# EAGLE design Rx (EAGLE 9.6.2)
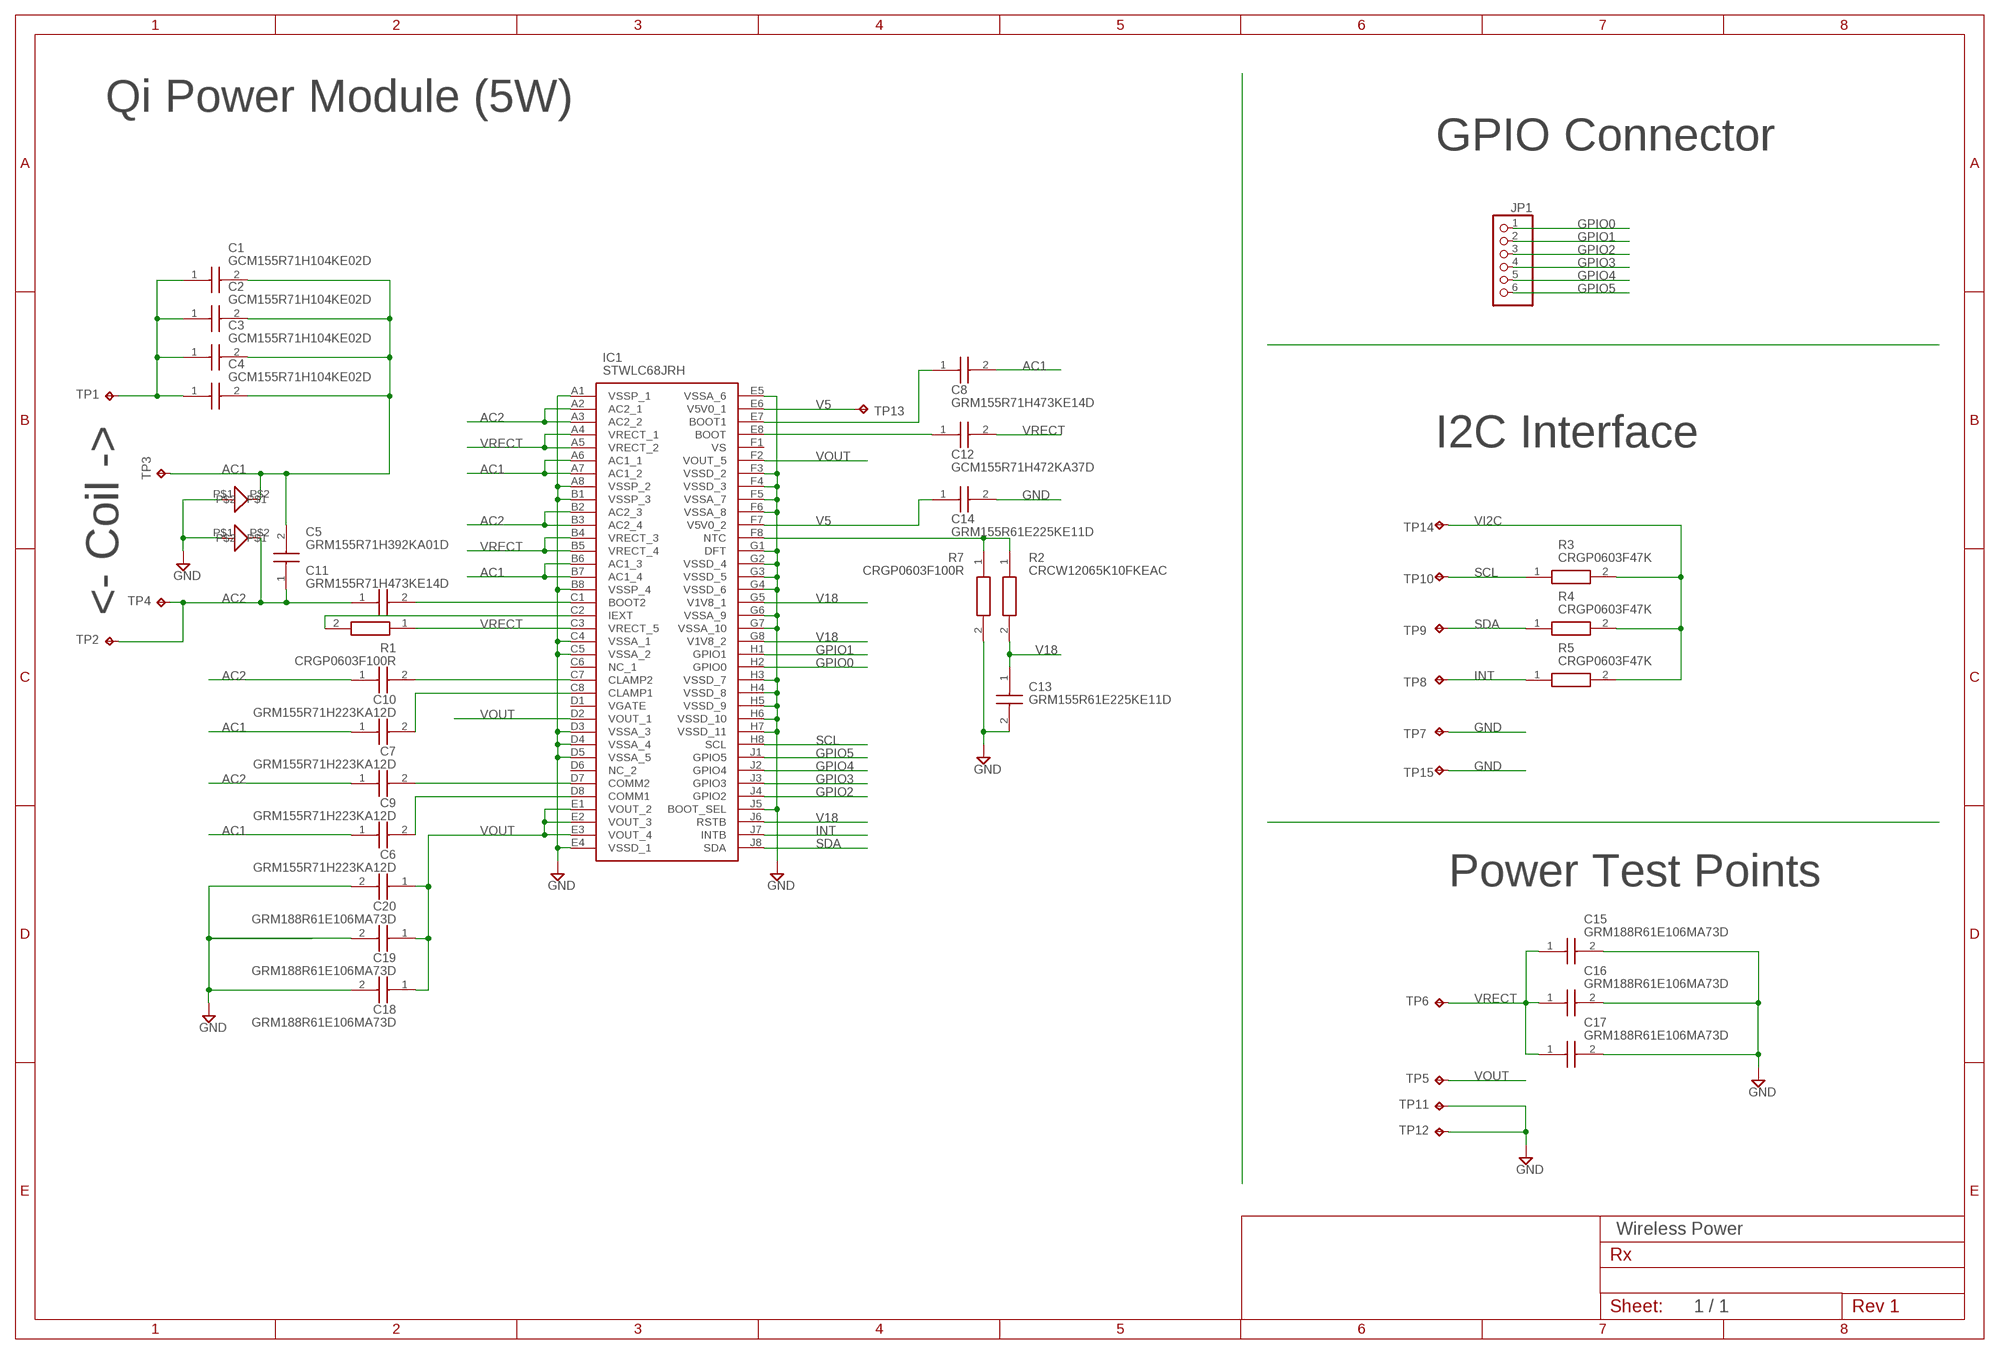
[diagram p0: schematic, sheet 1]

## Parts
C1  GCM155R71H104KE02D  [CAPC1005X55N]
C2  GCM155R71H104KE02D  [CAPC1005X55N]
C3  GCM155R71H104KE02D  [CAPC1005X55N]
C4  GCM155R71H104KE02D  [CAPC1005X55N]
C5  GRM155R71H392KA01D  [CAPC1005X55N]
C6  GRM155R71H223KA12D  [CAPC1005X55N]
C7  GRM155R71H223KA12D  [CAPC1005X55N]
C8  GRM155R71H473KE14D  [CAPC1005X55N]
C9  GRM155R71H223KA12D  [CAPC1005X55N]
C10  GRM155R71H223KA12D  [CAPC1005X55N]
C11  GRM155R71H473KE14D  [CAPC1005X55N]
C12  GCM155R71H472KA37D  [CAPC1005X55N]
C13  GRM155R61E225KE11D  [CAPC1005X55N]
C14  GRM155R61E225KE11D  [CAPC1005X55N]
C15  GRM188R61E106MA73D  [CAPC1608X90N]
C16  GRM188R61E106MA73D  [CAPC1608X90N]
C17  GRM188R61E106MA73D  [CAPC1608X90N]
C18  GRM188R61E106MA73D  [CAPC1608X90N]
C19  GRM188R61E106MA73D  [CAPC1608X90N]
C20  GRM188R61E106MA73D  [CAPC1608X90N]
IC1  STWLC68JRH  [BGA72C40P9X9_441X376X58]
JP1  PINHD-1X6  [1X06]
R1  CRGP0603F100R  [RESC1608X55N]
R2  CRCW12065K10FKEAC  [RESC3216X60N]
R3  CRGP0603F47K  [RESC1608X55N]
R4  CRGP0603F47K  [RESC1608X55N]
R5  CRGP0603F47K  [RESC1608X55N]
R7  CRGP0603F100R  [RESC1608X55N]
TP1  TPPAD1-13  [P1-13]
TP2  TPPAD1-13  [P1-13]
TP3  TPPAD1-13  [P1-13]
TP4  TPPAD1-13  [P1-13]
TP5  TPPAD1-13  [P1-13]
TP6  TPPAD1-13  [P1-13]
TP7  TPPAD1-13  [P1-13]
TP8  TPPAD1-13  [P1-13]
TP9  TPPAD1-13  [P1-13]
TP10  TPPAD1-13  [P1-13]
TP11  TPPAD1-13  [P1-13]
TP12  TPPAD1-13  [P1-13]
TP13  TPPAD1-13  [P1-13]
TP14  TPPAD1-13  [P1-13]
TP15  TPPAD1-13  [P1-13]
U$1  SMAJ16A  [SMAJ16A]
U$2  SMAJ16A  [SMAJ16A]

## Nets
AC1: C1.2 C2.2 C3.2 C4.2 C5.2 C6.1 C7.1 C8.2 IC1.A6(AC1_1) IC1.A7(AC1_2) IC1.B6(AC1_3) IC1.B7(AC1_4) TP3.TP U$1.P$2
AC2: C5.1 C9.1 C10.1 C11.1 IC1.A2(AC2_1) IC1.A3(AC2_2) IC1.B2(AC2_3) IC1.B3(AC2_4) TP2.TP TP4.TP U$2.P$2
GND: C13.2 C14.2 C15.2 C16.2 C17.2 C18.2 C19.2 C20.2 IC1.A1(VSSP_1) IC1.A8(VSSP_2) IC1.B1(VSSP_3) IC1.B8(VSSP_4) IC1.C4(VSSA_1) IC1.C5(VSSA_2) IC1.D3(VSSA_3) IC1.D4(VSSA_4) IC1.D5(VSSA_5) IC1.E4(VSSD_1) IC1.E5(VSSA_6) IC1.F3(VSSD_2) IC1.F4(VSSD_3) IC1.F5(VSSA_7) IC1.F6(VSSA_8) IC1.G1(DFT) IC1.G2(VSSD_4) IC1.G3(VSSD_5) IC1.G4(VSSD_6) IC1.G6(VSSA_9) IC1.G7(VSSA_10) IC1.H3(VSSD_7) IC1.H4(VSSD_8) IC1.H5(VSSD_9) IC1.H6(VSSD_10) IC1.H7(VSSD_11) IC1.J5(BOOT_SEL) R7.2 TP7.TP TP11.TP TP12.TP TP15.TP U$1.P$1 U$2.P$1
GPIO0: IC1.H2(GPIO0) JP1.1
GPIO1: IC1.H1(GPIO1) JP1.2
GPIO2: IC1.J4(GPIO2) JP1.3
GPIO3: IC1.J3(GPIO3) JP1.4
GPIO4: IC1.J2(GPIO4) JP1.5
GPIO5: IC1.J1(GPIO5) JP1.6
INT: IC1.J7(INTB) R5.1 TP8.TP
N$1: C6.2 IC1.D8(COMM1)
N$2: C7.2 IC1.C8(CLAMP1)
N$3: C8.1 IC1.E7(BOOT1)
N$4: C1.1 C2.1 C3.1 C4.1 TP1.TP
N$5: C11.2 IC1.C1(BOOT2)
N$6: C10.2 IC1.C7(CLAMP2)
N$7: C9.2 IC1.D7(COMM2)
N$8: C12.1 IC1.E8(BOOT)
N$9: IC1.C2(IEXT) R1.2
N$10: IC1.F8(NTC) R2.1 R7.1
SCL: IC1.H8(SCL) R3.1 TP10.TP
SDA: IC1.J8(SDA) R4.1 TP9.TP
V5: C14.1 IC1.E6(V5V0_1) IC1.F7(V5V0_2) TP13.TP
V18: C13.1 IC1.G5(V1V8_1) IC1.G8(V1V8_2) IC1.J6(RSTB) R2.2
VI2C: R3.2 R4.2 R5.2 TP14.TP
VOUT: C18.1 C19.1 C20.1 IC1.D2(VOUT_1) IC1.E1(VOUT_2) IC1.E2(VOUT_3) IC1.E3(VOUT_4) IC1.F2(VOUT_5) TP5.TP
VRECT: C12.2 C15.1 C16.1 C17.1 IC1.A4(VRECT_1) IC1.A5(VRECT_2) IC1.B4(VRECT_3) IC1.B5(VRECT_4) IC1.C3(VRECT_5) R1.1 TP6.TP
Unconnected: IC1.C6(NC_1) IC1.D1(VGATE) IC1.D6(NC_2) IC1.F1(VS)

## Notes on the sheet
- Qi Power Module (5W)
- GPIO Connector
- I2C Interface
- <- Coil ->
- Power Test Points
- Wireless Power
- 1 / 1

## Library data of the parts
C1-C4 = SamacSys_Parts:GCM155R71H104KE02D: Multilayer Ceramic Capacitors MLCC - SMD/SMT 0402 0.1uF 50volts X7R 10% Source: Datasheet <https://psearch.en.murata.com/capacitor/product/GCM155R71H104KE02#.html>; DESCRIPTION: Multilayer Ceramic Capacitors MLCC - SMD/SMT 0402 0.1uF 50volts X7R 10%; HEIGHT: 0.55mm; MANUFACTURER_NAME: Murata Electronics; MANUFACTURER_PART_NUMBER: GCM155R71H104KE02D; MOUSER_PART_NUMBER: 81-GCM155R71H104KE2D; MOUSER_PRICE-STOCK: https://www.mouser.co.uk/ProductDetail/Murata-Electronics/GCM155R71H104KE02D?qs=hNud%2FORuBR2sLZsqfoz4Fw%3D%3D
C5 = SamacSys_Parts:GRM155R71H392KA01D: Murata 0402 GRM 3.9nF Ceramic Multilayer Capacitor, 50 V dc, +125C, X7R Dielectric, +/-10% Source: Datasheet <https://datasheet.datasheetarchive.com/originals/distributors/Datasheets_SAMA/ec4f1577dddcc7a13ddad897a28002d3.pdf>; DESCRIPTION: Murata 0402 GRM 3.9nF Ceramic Multilayer Capacitor, 50 V dc, +125C, X7R Dielectric, +/-10%; HEIGHT: 0.55mm; MANUFACTURER_NAME: Murata Electronics; MANUFACTURER_PART_NUMBER: GRM155R71H392KA01D; MOUSER_PART_NUMBER: 81-GRM15R71H392KA01D; MOUSER_PRICE-STOCK: https://www.mouser.co.uk/ProductDetail/Murata-Electronics/GRM155R71H392KA01D?qs=sT7emLDNC7UjNLZb6dRgiw%3D%3D
C6 C7 C9 C10 = SamacSys_Parts:GRM155R71H223KA12D: Ceramic SMT capacitor 22nF 50Vdc Murata 0402 GRM 22nF Ceramic Multilayer Capacitor, 50 V dc, +125??C, X7R Dielectric, ??10% Source: Datasheet <https://datasheet.datasheetarchive.com/originals/distributors/Datasheets_SAMA/ec4f1577dddcc7a13ddad897a28002d3.pdf>; DESCRIPTION: Ceramic SMT capacitor 22nF 50Vdc Murata 0402 GRM 22nF Ceramic Multilayer Capacitor, 50 V dc, +125??C, X7R Dielectric, ??10%; HEIGHT: 0.55mm; MANUFACTURER_NAME: Murata Electronics; MANUFACTURER_PART_NUMBER: GRM155R71H223KA12D; MOUSER_PART_NUMBER: 81-GRM155R71H223KA12; MOUSER_PRICE-STOCK: https://www.mouser.co.uk/ProductDetail/Murata-Electronics/GRM155R71H223KA12D?qs=Dfh4SrgScWyE65FKEkixtw%3D%3D
C8 C11 = SamacSys_Parts:GRM155R71H473KE14D: Multilayer Ceramic Capacitors MLCC - SMD/SMT 0402 0.047uF 50volts X7R 10% Source: Datasheet <https://datasheet.datasheetarchive.com/originals/distributors/DKDS-10/191344.pdf>; DESCRIPTION: Multilayer Ceramic Capacitors MLCC - SMD/SMT 0402 0.047uF 50volts X7R 10%; HEIGHT: 0.55mm; MANUFACTURER_NAME: Murata Electronics; MANUFACTURER_PART_NUMBER: GRM155R71H473KE14D; MOUSER_PART_NUMBER: 81-GRM155R71H473KE4D; MOUSER_PRICE-STOCK: https://www.mouser.co.uk/ProductDetail/Murata-Electronics/GRM155R71H473KE14D?qs=hNud%2FORuBR2vKzdiNqYthQ%3D%3D
C12 = SamacSys_Parts:GCM155R71H472KA37D: Murata 0402 GCM 4.7nF Ceramic Multilayer Capacitor, 50 V dc, +125C, X7R Dielectric, +/-10% SMD Source: Datasheet <https://psearch.en.murata.com/capacitor/product/GCM155R71H472KA37#.html>; DESCRIPTION: Murata 0402 GCM 4.7nF Ceramic Multilayer Capacitor, 50 V dc, +125C, X7R Dielectric, +/-10% SMD; HEIGHT: 0.55mm; MANUFACTURER_NAME: Murata Electronics; MANUFACTURER_PART_NUMBER: GCM155R71H472KA37D; MOUSER_PART_NUMBER: 81-GCM155R71H472K37D; MOUSER_PRICE-STOCK: https://www.mouser.co.uk/ProductDetail/Murata-Electronics/GCM155R71H472KA37D?qs=QDXoN8f0aYJi%2FpaJLEInpw%3D%3D
C13 C14 = SamacSys_Parts:GRM155R61E225KE11D: Multilayer Ceramic Capacitors MLCC - SMD/SMT 0402 2.2uF 25volts X5R 10% Source: Datasheet <https://psearch.en.murata.com/capacitor/product/GRM155R61E225KE11#.html>; DESCRIPTION: Multilayer Ceramic Capacitors MLCC - SMD/SMT 0402 2.2uF 25volts X5R 10%; HEIGHT: 0.55mm; MANUFACTURER_NAME: Murata Electronics; MANUFACTURER_PART_NUMBER: GRM155R61E225KE11D; MOUSER_PART_NUMBER: 81-GRM155R61E225KE1D; MOUSER_PRICE-STOCK: https://www.mouser.co.uk/ProductDetail/Murata-Electronics/GRM155R61E225KE11D?qs=eeBpzGFlv%252B8X58bIUndZvA%3D%3D
C15-C20 = SamacSys_Parts:GRM188R61E106MA73D: Multilayer Ceramic Capacitors MLCC - SMD/SMT 0603 10uF 25volts X5R 20% Source: Datasheet <https://psearch.en.murata.com/capacitor/product/GRM188R61E106MA73#.html>; DESCRIPTION: Multilayer Ceramic Capacitors MLCC - SMD/SMT 0603 10uF 25volts X5R 20%; HEIGHT: 0.9mm; MANUFACTURER_NAME: Murata Electronics; MANUFACTURER_PART_NUMBER: GRM188R61E106MA73D; MOUSER_PART_NUMBER: 81-GRM188R61E106MA3D; MOUSER_PRICE-STOCK: https://www.mouser.co.uk/ProductDetail/Murata-Electronics/GRM188R61E106MA73D?qs=PoXZt%252B2CjACpktoD15Kv0Q%3D%3D
IC1 = SamacSys_Parts:STWLC68JRH: Wireless Charging ICs Qi-compliant inductive wireless power receiver for 5W applications Source: Datasheet <https://componentsearchengine.com/Datasheets/1/STWLC68JRH.pdf>; DESCRIPTION: Wireless Charging ICs Qi-compliant inductive wireless power receiver for 5W applications; HEIGHT: 0.585mm; MANUFACTURER_NAME: STMicroelectronics; MANUFACTURER_PART_NUMBER: STWLC68JRH; MOUSER_PART_NUMBER: 511-STWLC68JRH; MOUSER_PRICE-STOCK: https://www.mouser.co.uk/ProductDetail/STMicroelectronics/STWLC68JRH?qs=GBLSl2AkirtnTJOZ01bmug%3D%3D
JP1 = pinhead:PINHD-1X6: PIN HEADER
R1 R7 = SamacSys_Parts:CRGP0603F100R: Thick Film Resistors - SMD CRGP 0603 100R 1% SMD Resistor Source: Datasheet <https://datasheet.datasheetarchive.com/originals/distributors/DKDS-39/9272.pdf>; DESCRIPTION: Thick Film Resistors - SMD CRGP 0603 100R 1% SMD Resistor; HEIGHT: 0.55mm; MANUFACTURER_NAME: TE Connectivity; MANUFACTURER_PART_NUMBER: CRGP0603F100R; MOUSER_PART_NUMBER: 279-CRGP0603F100R; MOUSER_PRICE-STOCK: https://www.mouser.co.uk/ProductDetail/TE-Connectivity-Holsworthy/CRGP0603F100R?qs=wUXugUrL1qxgC4nsawP%2FRA%3D%3D
R2 = SamacSys_Parts:CRCW12065K10FKEAC: Thick Film Resistors - SMD 1/4Watt 5.1Kohms 1% Commercial Use Source: Datasheet <http://componentsearchengine.com/Datasheets/1/CRCW12065K10FKEAC.pdf>; DESCRIPTION: Thick Film Resistors - SMD 1/4Watt 5.1Kohms 1% Commercial Use; HEIGHT: 0.6mm; MANUFACTURER_NAME: Vishay; MANUFACTURER_PART_NUMBER: CRCW12065K10FKEAC; MOUSER_PART_NUMBER: 71-CRCW12065K10FKEAC; MOUSER_PRICE-STOCK: https://www.mouser.co.uk/ProductDetail/Vishay-Dale/CRCW12065K10FKEAC?qs=E3Y5ESvWgWNktrgtHh1MhA%3D%3D
R3-R5 = SamacSys_Parts:CRGP0603F47K: 47k 0603 Thick Film Resistor +/-1% 0.25W CRGP0603F47K Source: Datasheet <https://4donline.ihs.com/images/VipMasterIC/IC/TYEL/TYEL-S-A0005460475/TYEL-S-A0005460475-1.pdf?hkey=52A5661711E402568146F3353EA87419>; DESCRIPTION: 47k 0603 Thick Film Resistor +/-1% 0.25W CRGP0603F47K; HEIGHT: 0.55mm; MANUFACTURER_NAME: TE Connectivity; MANUFACTURER_PART_NUMBER: CRGP0603F47K; MOUSER_PART_NUMBER: 279-CRGP0603F47K; MOUSER_PRICE-STOCK: https://www.mouser.co.uk/ProductDetail/TE-Connectivity-Holsworthy/CRGP0603F47K?qs=wUXugUrL1qyWZ1Sw7fH%2FgQ%3D%3D
TP1-TP15 = testpad:TP: Test pad
U$1 U$2 = SamacSys_Parts:SMAJ16A

## Board
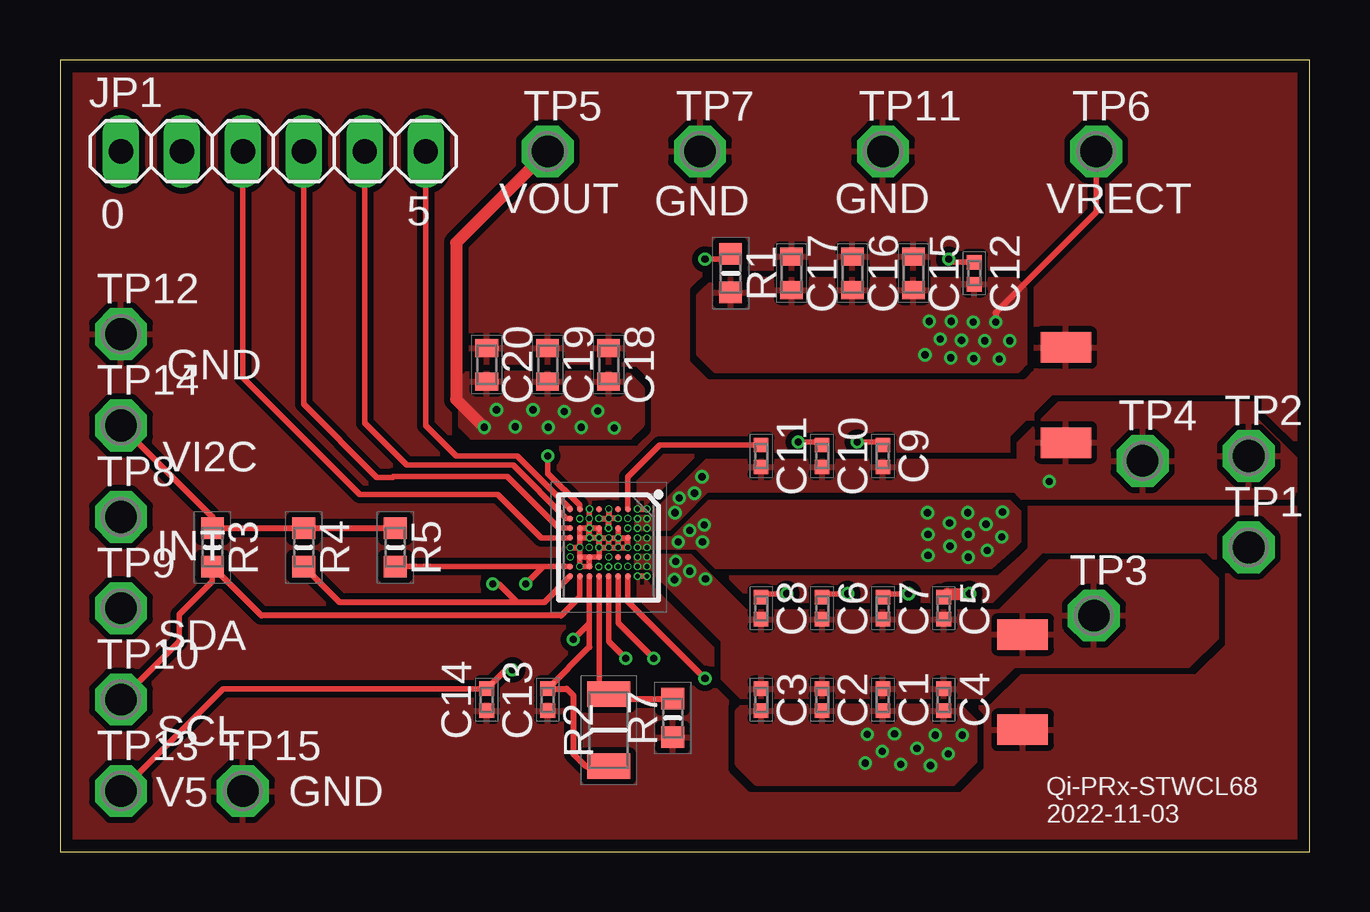
[diagram p1: board, top side]
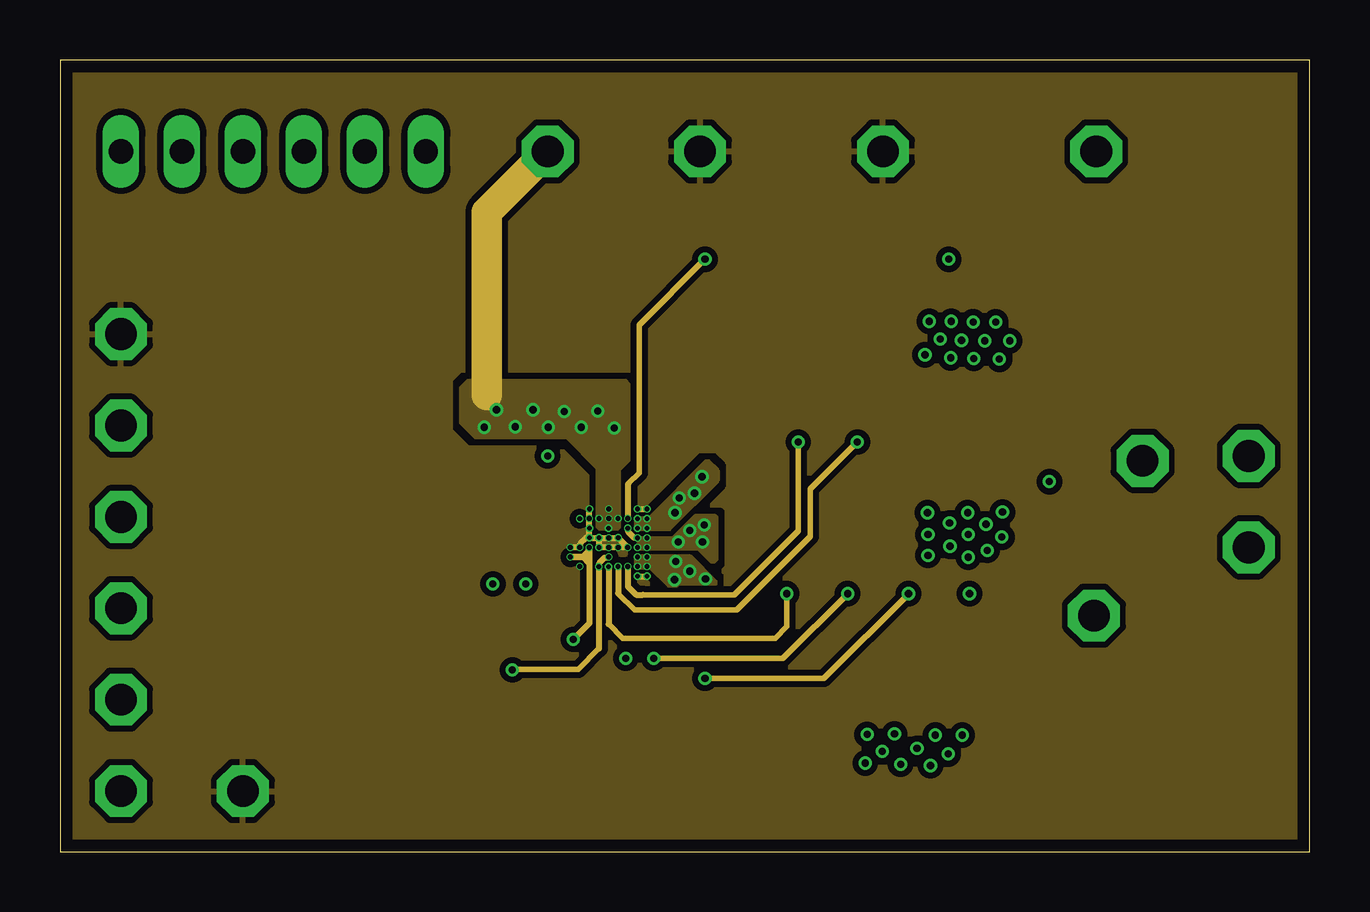
[diagram p2: board, inner layer Route2]
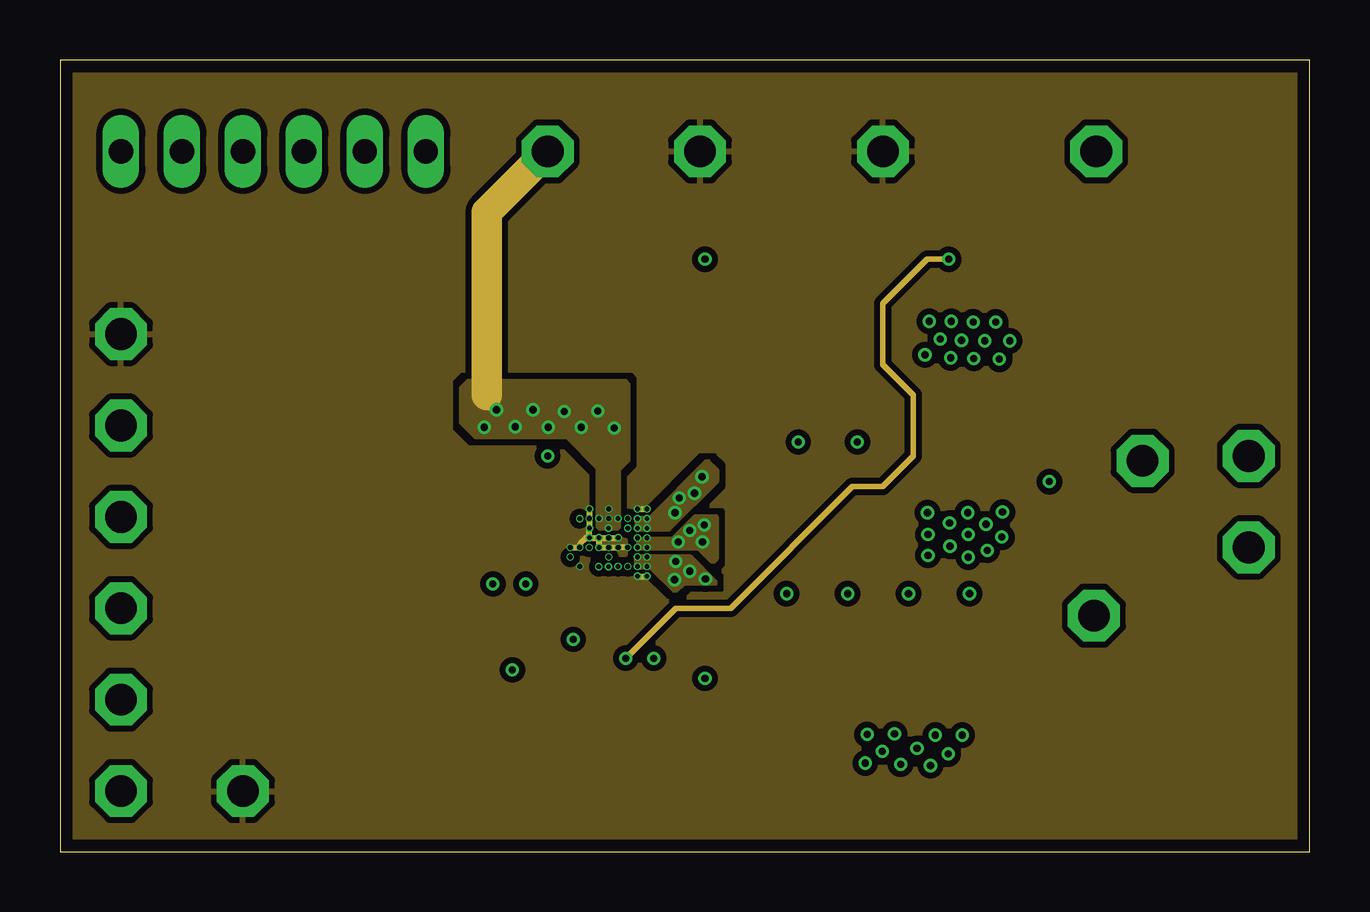
[diagram p3: board, inner layer Route15]
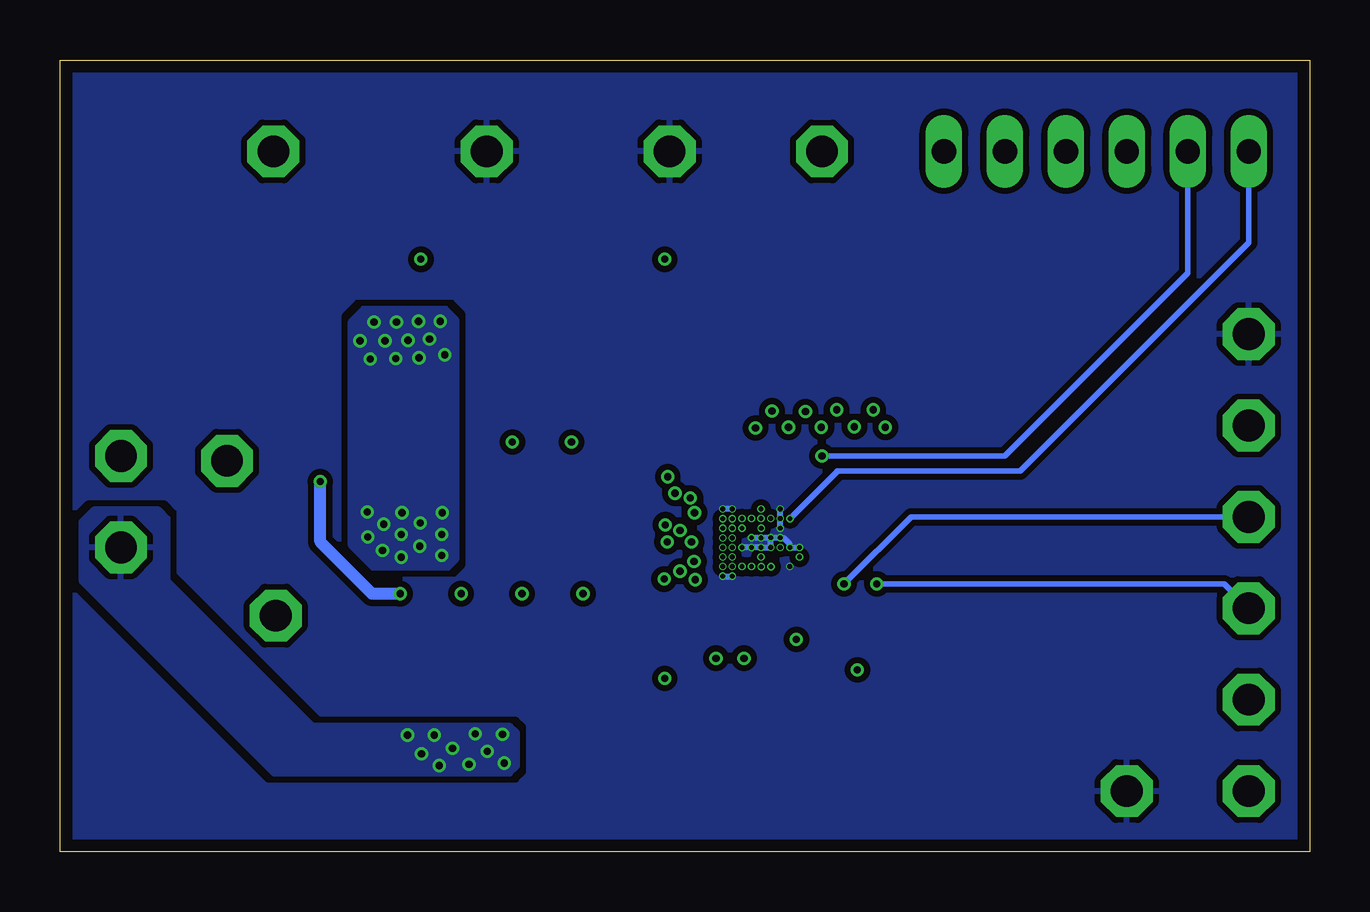
[diagram p4: board, bottom side, seen from below]

Size 52.07 x 33.02 mm. Coordinates in mm from the lower left corner, seen from the top.
Outline: 0,0 52.07,0 52.07,33.02 0,33.02 0,0
Copper layers (1+2*15+16): Top 0.0178mm / dielectric 12mil / Route2 0.0356mm / dielectric 28mil / Route15 0.0356mm / dielectric 12mil / Bottom 0.0178mm
Design rules "SSC-EAGLE-4Lyr_v1.0.0.3 *": minimum track width 6mil, minimum drill 0.2mm, track to track 4mil, track to pad 4mil, pad to pad 4mil, via to via 4mil, smd to smd 4mil, copper to edge 20mil, drill to drill 4mil, minimum pad ring 8mil, minimum via ring 2mil, stop-mask expansion 3mil, vias tented up to drill 0mil, thermal gap 10mil

### Footprints (pad centres in the part's own frame; a part is rotated, then mirrored left to right if it is on the bottom)
CAPC1005X55N = smd 0.6 x 0.62: 1 -0.46,0; 2 0.46,0
CAPC1608X90N = smd 0.75 x 0.94: 1 -0.7,0; 2 0.7,0
BGA72C40P9X9_441X376X58 = smd 0.242 x 0.242: A1 -1.6,1.6; A2 -1.2,1.6; A3 -0.8,1.6; A4 -0.4,1.6; A5 0,1.6; A6 0.4,1.6; A7 0.8,1.6; A8 1.2,1.6; B1 -1.6,1.2; B2 -1.2,1.2; B3 -0.8,1.2; B4 -0.4,1.2; B5 0,1.2; B6 0.4,1.2; B7 0.8,1.2; B8 1.2,1.2; C1 -1.6,0.8; C2 -1.2,0.8; C3 -0.8,0.8; C4 -0.4,0.8; C5 0,0.8; C6 0.4,0.8; C7 0.8,0.8; C8 1.2,0.8; D1 -1.6,0.4; D2 -1.2,0.4; D3 -0.8,0.4; D4 -0.4,0.4; D5 0,0.4; D6 0.4,0.4; D7 0.8,0.4; D8 1.2,0.4; E1 -1.6,0; E2 -1.2,0; E3 -0.8,0; E4 -0.4,0; E5 0,0; E6 0.4,0; E7 0.8,0; E8 1.2,0; F1 -1.6,-0.4; F2 -1.2,-0.4; F3 -0.8,-0.4; F4 -0.4,-0.4; F5 0,-0.4; F6 0.4,-0.4; F7 0.8,-0.4; F8 1.2,-0.4; G1 -1.6,-0.8; G2 -1.2,-0.8; G3 -0.8,-0.8; G4 -0.4,-0.8; G5 0,-0.8; G6 0.4,-0.8; G7 0.8,-0.8; G8 1.2,-0.8; H1 -1.6,-1.2; H2 -1.2,-1.2; H3 -0.8,-1.2; H4 -0.4,-1.2; H5 0,-1.2; H6 0.4,-1.2; H7 0.8,-1.2; H8 1.2,-1.2; J1 -1.6,-1.6; J2 -1.2,-1.6; J3 -0.8,-1.6; J4 -0.4,-1.6; J5 0,-1.6; J6 0.4,-1.6; J7 0.8,-1.6; J8 1.2,-1.6
1X06 = drill 1.016 long: 1 -6.35,0; 2 -3.81,0; 3 -1.27,0; 4 1.27,0; 5 3.81,0; 6 6.35,0
RESC1608X55N = smd 0.9 x 0.95: 1 -0.8,0; 2 0.8,0
RESC3216X60N = smd 1.05 x 1.8: 1 -1.5,0; 2 1.5,0
P1-13 = drill 1.321 pad 2.159 octagon: TP 0,0
SMAJ16A = smd 1.27 x 2.1: P$1 -1.985,0; P$2 1.985,0

### Placement (x,y rotation side)
C1  34.29,6.35 90 top
C2  31.75,6.35 90 top
C3  29.21,6.35 90 top
C4  36.83,6.35 90 top
C5  36.83,10.16 270 top
C6  31.75,10.16 90 top
C7  34.29,10.16 90 top
C8  29.21,10.16 270 top
C9  34.29,16.51 90 top
C10  31.75,16.51 90 top
C11  29.21,16.51 90 top
C12  38.1,24.13 270 top
C13  20.32,6.35 270 top
C14  17.78,6.35 270 top
C15  35.56,24.13 90 top
C16  33.02,24.13 90 top
C17  30.48,24.13 90 top
C18  22.86,20.32 90 top
C19  20.32,20.32 90 top
C20  17.78,20.32 90 top
IC1  22.86,12.7 270 top
JP1  8.89,29.21 0 top
R1  27.94,24.13 90 top
R2  22.86,5.08 270 top
R3  6.35,12.7 90 top
R4  10.16,12.7 90 top
R5  13.97,12.7 90 top
R7  25.53,5.59 270 top
TP1  49.53,12.7 0 top
TP2  49.53,16.51 0 top
TP3  43.08,9.86 0 top
TP4  45.11,16.31 0 top
TP5  20.32,29.21 0 top
TP6  43.18,29.21 0 top
TP7  26.67,29.21 0 top
TP8  2.54,13.97 0 top
TP9  2.54,10.16 0 top
TP10  2.54,6.35 0 top
TP11  34.29,29.21 0 top
TP12  2.54,21.59 0 top
TP13  2.54,2.54 0 top
TP14  2.54,17.78 0 top
TP15  7.62,2.54 0 top
U$1  40.11,7.09 90 top
U$2  41.91,19.05 270 top

### Tracks (layer width: path | path; a pad name or v marks a point on that pad's centre or on a via)
AC1  (via drill 0.2 pad 0.25, 0.3 pad 0.55)
  Top 0.254: IC1.B6 | IC1.A6
  other vias: 26.24,11.71 25.6,11.35 26.9,11.38 25.65,12.12 24.06,12.3 24.46,12.3 24.46,11.9 24.06,11.9
  pour Top: 48.26,11.43 48.26,8.89 47.04,7.67 39.75,7.67 38.46,6.38 28.37,6.38 27.56,7.19 27.56,8.79 24.56,11.79 24.08,11.79 23.98,11.89 23.95,11.89 23.95,12.29 24.08,12.42 26.29,12.42 28.6,10.11 39.14,10.11 41.22,12.19 47.5,12.19
  pour Top (no thermals): 27.56,8.79 24.56,11.79 24.05,11.79 23.95,11.89 23.95,12.29 24.08,12.42 26.11,12.42 28.12,10.41 28.12,9.35
  pour Top: 41.25,11.61 43.61,11.61 43.87,11.86 47.27,11.86 47.42,11.71 47.42,8.89 46.71,8.18 39.55,8.18 37.87,6.5 28.45,6.5 28.04,6.91 28.04,9.75 28.27,9.98 40.06,9.98 40.26,10.19 40.26,10.62
  pour Route15 (no thermals): 24.05,12.29 26.24,12.29 27.3,11.23 25.96,11.23 25.63,10.9 24.64,11.89 24.05,11.89
  pour Route2 (no thermals): 24.05,12.29 26.24,12.29 27.3,11.23 25.76,11.23 25.65,11.13 25.4,11.13 24.64,11.89 24.05,11.89
AC2  (via drill 0.2 pad 0.25, 0.3 pad 0.55)
  Top 0.254: IC1.A2 | IC1.B2
  Top 0.508: C5.1 36.98,10.77 v37.9,10.77
  Bottom 0.508: v37.9,10.77 39.06,10.77 41.22,12.93 v41.22,15.44
  other vias: 26.75,15.65 25.81,14.76 25.63,14.15 26.44,14.96 24.46,13.9 24.06,13.9 24.46,13.5 24.06,13.5
  pour Top: 51.69,14.99 26.29,14.99 24.69,13.39 24,13.39 24,14.02 24.56,14.02 26.92,16.38 40.51,16.38 42.67,18.54 49.02,18.54
  pour Top (no thermals): 26.92,16.38 24.56,14.02 24.05,14.02 23.95,13.92 23.95,13.51 24.03,13.44 25.43,13.44 27.57,15.58 26.92,16.23
  pour Top: 49.73,18.72 41.61,18.72 39.93,17.04 39.93,15.9 44.96,15.9 45.06,16 45.06,17.86 45.16,17.96 49.43,17.96 49.73,18.26
  pour Top: 51.41,14.71 40.06,14.71 40.82,15.47 44.63,15.47 45.39,16.23 45.39,17.93 45.72,18.26 49.71,18.26 51.71,16.26
  pour Top: 47.88,14.71 40.06,14.71 39.67,15.09 43.99,15.09 45.09,16.18 45.09,17.09 46,18.01 48.79,18.01 48.82,17.98 48.82,15.65
  pour Top: 28.12,16.26 35.79,16.26 36.14,15.9 35.64,15.39 35.64,15.24 28.07,15.24 27.89,15.42 27.89,16.03
  pour Route2 (no thermals): 24.05,13.89 24.59,13.89 26.97,16.28 27.36,15.9 27.36,15.49 25.35,13.49 24.05,13.49
  pour Route15 (no thermals): 24.08,13.89 24.05,13.87 24.05,13.49 25.35,13.49 27.36,15.49 27.36,15.9 26.97,16.28 24.59,13.89
GND  (via drill 0.2 pad 0.25)
  Top 0.229: IC1.G1 IC1.G2 IC1.G3 | IC1.G3 IC1.H3 IC1.H4 | IC1.G4 IC1.H4 | IC1.G3 IC1.F3 IC1.F4 IC1.E4 IC1.D4 | IC1.D4 IC1.D3 | IC1.D5 IC1.D4 | IC1.H4 IC1.H5 IC1.H6 | IC1.H6 IC1.H7 IC1.G7 IC1.G6 | IC1.G6 IC1.H6 | IC1.G6 IC1.F6 | IC1.F6 IC1.F5 | IC1.E4 IC1.E5 | IC1.A8 IC1.B8
  Top 0.254: IC1.A8 | IC1.B8 | IC1.C5 | IC1.E4 | IC1.F6 | IC1.G2 | v21.65,12.7 IC1.H5 IC1.J5 | IC1.D4 IC1.C4 IC1.C5 | IC1.C5 IC1.D5 IC1.E5 IC1.F5 IC1.F4 IC1.G4 IC1.G3 | IC1.B1 IC1.A1
  Route2 0.254: IC1.G4 IC1.F4 | IC1.G4 IC1.G3 IC1.G2 IC1.G1 | IC1.G4 21.92,13.1 21.68,12.85 21.68,12.72 v21.65,12.7 IC1.J5 | IC1.F4 IC1.F5 IC1.E5 IC1.D5 IC1.C5 IC1.D4 | IC1.F4 IC1.E4 IC1.D4 | IC1.D4 | IC1.B8 IC1.A8 | IC1.B1 IC1.A1
  Route15 0.254: IC1.G4 IC1.F4 | IC1.F4 IC1.F5 IC1.E5 IC1.D5 IC1.C5 | IC1.G4 IC1.G3 IC1.G2 IC1.G1 | IC1.B1 IC1.A1 | IC1.B8 IC1.A8 | IC1.F4 IC1.E4 IC1.D4 | IC1.G4 21.92,13.1 21.68,12.85 21.68,12.72 v21.65,12.7 IC1.J5
  Bottom 0.254: IC1.F4 IC1.G4 22.04,13.08 21.9,13.08 21.68,12.85 21.68,12.72 v21.65,12.7 IC1.J5 | IC1.G3 IC1.G2 IC1.G1 | IC1.B1 IC1.A1 | IC1.A8 IC1.B8 | IC1.F4 IC1.E4 IC1.D4 | IC1.C5 IC1.D5 IC1.E5 IC1.F5 IC1.F4
  other vias: 24.46,14.3 24.06,14.3 24.46,11.5 24.06,11.5 23.66,12.7 23.26,13.1 23.26,12.7 22.86,13.1 22.86,12.7 22.46,13.1 22.46,12.7 22.06,14.3 22.06,13.9 22.06,13.5 22.06,13.1 21.26,12.7 21.66,11.9
  pour Top (isolate 0.254, rank 3): 0,33.02 52.07,33.02 52.07,0 0,0
  pour Route2 (isolate 0.254, rank 3): 0,33.02 0,0 52.07,0 52.07,33.02
  pour Route15 (isolate 0.254, rank 3): 0,33.02 0,0 52.07,0 52.07,33.02
  pour Bottom (isolate 0.254, rank 3): 0,33.02 0,0 52.07,0 52.07,33.02
GPIO0  (via drill 0.2 pad 0.25)
  Top 0.254: IC1.H2 | IC1.H2 v21.65,13.89
  Bottom 0.229: JP1.1 2.54,25.4 12.06,15.88 19.68,15.88
  Bottom 0.254: v21.65,13.89 19.68,15.86 19.68,15.88
GPIO1  (via drill 0.3 pad 0.55)
  Top 0.229: IC1.H1 21.65,14.31 21.65,14.46 20.32,15.79 v20.32,16.51
  Bottom 0.229: v20.32,16.51 12.7,16.51 5.08,24.13 JP1.2
GPIO2
  Top 0.229: IC1.J4 20.05,13.1 18.24,14.91 12.5,14.91 7.62,19.79 JP1.3
GPIO3
  Top 0.229: IC1.J3 20.79,13.5 18.64,15.65 13.89,15.65 13.87,15.62 13.21,15.62 10.16,18.67 JP1.4
GPIO4
  Top 0.229: IC1.J2 21.25,13.91 21.1,13.91 18.88,16.13 14.45,16.13 12.7,17.88 JP1.5
GPIO5
  Top 0.229: IC1.J1 19.05,16.51 16.51,16.51 15.24,17.78 JP1.6
INT  (via drill 0.3 pad 0.55)
  Top 0.229: IC1.J7 20.13,11.9 | 20.13,11.9 R5.1 | v19.41,11.18 20.13,11.9
  Bottom 0.229: v19.41,11.18 16.61,13.97 TP8.TP
N$1  (via drill 0.3 pad 0.55)
  Top 0.229: C6.2 31.9,10.77 v32.82,10.77 | IC1.D8 23.26,9.56 v24.74,8.08
  Route2 0.229: v32.82,10.77 30.12,8.08 v24.74,8.08
N$2  (via drill 0.3 pad 0.55)
  Top 0.229: C7.2 34.44,10.77 v35.36,10.77 | IC1.C8 23.66,10.45 v26.87,7.24
  Route2 0.229: v35.36,10.77 31.83,7.24 v26.87,7.24
N$3  (via drill 0.2 pad 0.25, 0.3 pad 0.55)
  Top 0.229: C8.1 29.36,10.77 v30.28,10.77
  Top 0.254: IC1.E7 v22.85,11.89
  Route2 0.229: v30.28,10.77 30.28,9.4 29.79,8.91 23.44,8.91 22.86,9.5
  Route2 0.254: v22.85,11.89 v22.86,11.88 22.86,9.5
N$4  (via drill 0.3 pad 0.55)
  other vias: 33.63,4.9 34.77,4.93 35.71,4.32 34.26,4.19 33.55,3.71 35.03,3.66 36.27,3.61 37.01,4.09 36.47,4.88 37.59,4.88
  pour Bottom (no thermals): 32.92,4.65 38.2,4.65 38.2,3.89 37.62,3.3 33.55,3.3 32.92,3.94
  pour Top: 28.7,6.17 37.52,6.17 38.2,5.49 38.2,3.73 37.24,2.77 29.29,2.77 28.35,3.71 28.35,5.82
  pour Top: 28.4,6.02 37.44,6.02 37.57,5.89 37.57,4.47 32.59,4.47 30.99,2.87 29.03,2.87 28.24,3.66 28.24,5.87
  pour Bottom: 47.96,14.27 50.67,14.27 51.18,13.77 51.18,11.3 43.15,3.28 33.32,3.28 33.02,3.58 33.02,4.98 33.3,5.26 41.53,5.26 47.57,11.3 47.57,13.89
N$5
  Top 0.229: IC1.C1 23.66,15.63 25,16.97 C11.2
N$6  (via drill 0.2 pad 0.25, 0.3 pad 0.55)
  Top 0.229: v30.76,17.09 31.63,17.09 C10.2
  Top 0.254: IC1.C7
  Route2 0.229: v30.76,17.09 30.76,13.39 28.09,10.72 24.28,10.72
  Route2 0.254: IC1.C7 23.66,11.06 24,10.72 24.28,10.72
  other vias: 23.66,11.9
N$7  (via drill 0.2 pad 0.25, 0.3 pad 0.55)
  Top 0.229: v33.22,17.09 34.17,17.09 C9.2
  Top 0.254: IC1.D7 v23.25,11.9
  Route2 0.229: v33.22,17.09 31.27,15.14 31.27,13.16 28.19,10.08 23.95,10.08 23.27,10.77
  Route2 0.254: v23.25,11.9 23.25,10.78 23.27,10.77
N$8  (via drill 0.3 pad 0.55)
  Top 0.229: v23.57,8.08 22.86,8.79 IC1.E8 | C12.1 37.16,24.59 v37.03,24.71
  Route15 0.229: v23.57,8.08 25.65,10.16 27.94,10.16 33.02,15.24 34.29,15.24 35.56,16.51 35.56,19.05 34.29,20.32 34.29,22.86 36.14,24.71 v37.03,24.71
N$9  (via drill 0.2 pad 0.25, 0.3 pad 0.55)
  Top 0.229: R1.2 27.72,24.71 v26.87,24.71
  Top 0.254: IC1.C2
  Route2 0.229: v26.87,24.71 24.13,21.97 24.13,15.8 23.69,15.35
  Route2 0.254: IC1.C2 23.68,13.92 23.68,15.35 23.69,15.35
  other vias: 23.66,13.9
N$10
  Top 0.229: IC1.F8 22.46,6.98
  Top 0.254: 22.46,6.98 R2.1 23.05,6.39 R7.1
SCL
  Top 0.229: IC1.H8 21.66,10.64 20.88,9.86 | TP10.TP 4.98,8.79 4.98,9.91 6.35,11.28 R3.1
  Top 0.254: 20.88,9.86 8.39,9.86 R3.1
SDA  (via drill 0.3 pad 0.55)
  Top 0.229: IC1.J8 20.17,10.41 | v18.03,11.18 18.29,11.18 19.05,10.41
  Top 0.254: R4.1 11.65,10.41 19.05,10.41 20.17,10.41
  Bottom 0.229: v18.03,11.18 3.56,11.18 TP9.TP
V5  (via drill 0.2 pad 0.25, 0.3 pad 0.55)
  Top 0.229: v18.85,7.59 18.57,7.59 C14.1 6.81,6.81 TP13.TP
  Top 0.254: IC1.E6 | IC1.F7 v22.45,11.9
  Route2 0.229: 22.45,8.48 21.59,7.62 18.87,7.62 v18.85,7.59
  Route2 0.254: 22.45,8.48 v22.45,11.89 v22.45,11.9 22.47,11.92 22.47,12.05 22.69,12.27 22.84,12.27 IC1.E6
  other vias: 22.86,12.3
V18  (via drill 0.2 pad 0.25, 0.3 pad 0.55)
  Top 0.229: 22.06,8.55 IC1.G8 22.06,9.54 v21.39,8.87
  Top 0.254: 22.06,8.55 C13.1 21.11,6.81 21.39,6.53 21.39,4.09 21.9,3.58 R2.2 | IC1.G5 | IC1.J6
  Route2 0.229: 22.05,9.53 v21.39,8.87
  Route2 0.254: 22.06,12.04 IC1.G5 22.03,12.67 22.03,12.54 21.81,12.32 21.28,12.32 IC1.J6 21.8,12.3 22.04,12.06 | 22.06,12.04 22.06,9.54 22.05,9.53 | 22.04,12.06 | 22.04,12.06 22.06,12.04
  other vias: 22.06,12.7 21.26,12.3
VI2C
  Top 0.254: TP14.TP 6.35,13.97 R3.2 R4.2 R5.2
VOUT  (via drill 0.2 pad 0.25, 0.3 pad 0.55)
  Top 0.254: IC1.F2 IC1.E2 | IC1.E2 v23.25,13.9 IC1.D2 | IC1.E1 IC1.E2 | v22.85,13.5 IC1.E3 IC1.E2
  Top 0.508: TP5.TP 16.51,25.4 16.51,18.87 v17.68,17.7
  Route2 0.254: 17.78,19.05 17.78,18.85 v18.19,18.44
  Route2 1.27: TP5.TP 17.78,26.67 17.78,19.05
  Route15 0.254: 17.78,19.05 17.78,18.85 v18.19,18.44
  Route15 1.27: TP5.TP 17.78,26.67 17.78,19.05
  other vias: 21.72,17.7 23.09,17.68 20.35,17.7 22.4,18.39 21.01,18.36 19.71,18.44 18.97,17.73 22.86,14.3 22.86,13.9 22.46,13.9
  pour Route15 (no thermals): 22.35,13.54 22.35,15.98 21.11,17.22 17.3,17.22 16.66,17.86 16.66,19.38 16.99,19.71 23.57,19.71 23.75,19.53 23.75,16.31 23.34,15.9 23.34,13.51 23.24,13.41 22.48,13.41
  pour Route2 (no thermals): 22.35,13.54 22.35,15.98 21.11,17.22 17.3,17.22 16.66,17.86 16.66,19.38 16.99,19.71 23.57,19.71 23.75,19.53 23.75,16.31 23.34,15.9 23.34,13.51 23.24,13.41 22.48,13.41
  pour Top: 16.97,19.94 23.62,19.94 24.23,19.33 24.23,17.81 23.72,17.3 17.17,17.3 16.71,17.75 16.71,19.68
VRECT  (via drill 0.2 pad 0.25, 0.3 pad 0.55)
  Top 0.229: TP6.TP 43.18,26.67 39.37,22.86
  Top 0.254: IC1.A4 | IC1.B4 | IC1.C3 | 39.37,22.86 38.99,22.48 v38.99,22.1
  Route2 0.254: IC1.C3 23.68,13.47 23.68,13.34 23.93,13.1 IC1.B4
  other vias: 37.82,14.15 39.27,14.17 36.14,14.15 38.63,12.57 37.85,12.29 38.58,13.67 39.24,13.13 36.17,13.23 37.08,12.75 37.06,13.72 37.85,13.23 36.17,12.37 36.04,20.73 37.11,20.6 38.07,20.57 39.14,20.55 39.57,21.31 38.53,21.31 37.57,21.34 36.68,21.39 36.22,22.12 37.13,22.12 38.05,22.1 26.77,12.93 26.85,13.64 25.76,12.93 26.24,13.41 24.46,13.1 24.06,13.1 24.46,12.7 24.06,12.7 23.66,13.5
  pour Top (no thermals): 24,13.16 25.5,13.16 27.03,14.68 39.57,14.68 40.03,14.22 40.03,12.93 39.73,12.62 38.81,11.81 27.33,11.81 26.52,12.62 24.03,12.62 24,12.65
  pour Bottom: 35.56,22.2 35.56,12.19 35.92,11.84 39.01,11.84 39.95,12.78 39.95,22.12 39.42,22.66 36.02,22.66
  pour Top: 39.8,23.85 27.28,23.85 26.62,23.19 26.62,20.78 27.3,20.09 39.9,20.09 40.21,20.4 40.21,23.44
  pour Route2 (no thermals): 24.13,12.7 26.62,12.7 27.2,12.12 27.33,12.24 27.33,13.92 27.28,13.97 26.49,13.97 25.55,13.03 24.1,13.03 24.13,13
  pour Route15 (no thermals): 24.13,13 24.16,13.03 25.55,13.03 26.49,13.97 27.3,13.97 27.33,13.94 27.33,12.24 27.2,12.12 26.64,12.67 24.1,12.67 24.13,12.7

### Text on the board
tNames: VOUT | GND | GND | VRECT | 0 | 5 | GND | VI2C | INT | SDA | SCL | V5 | GND | Qi-PRx-STWCL68 / 2022-11-03